# Altium schematic sheet CPU_Programmer_Schem.SchDoc
size A3; SheetNumber: 2; SheetTotal: 2
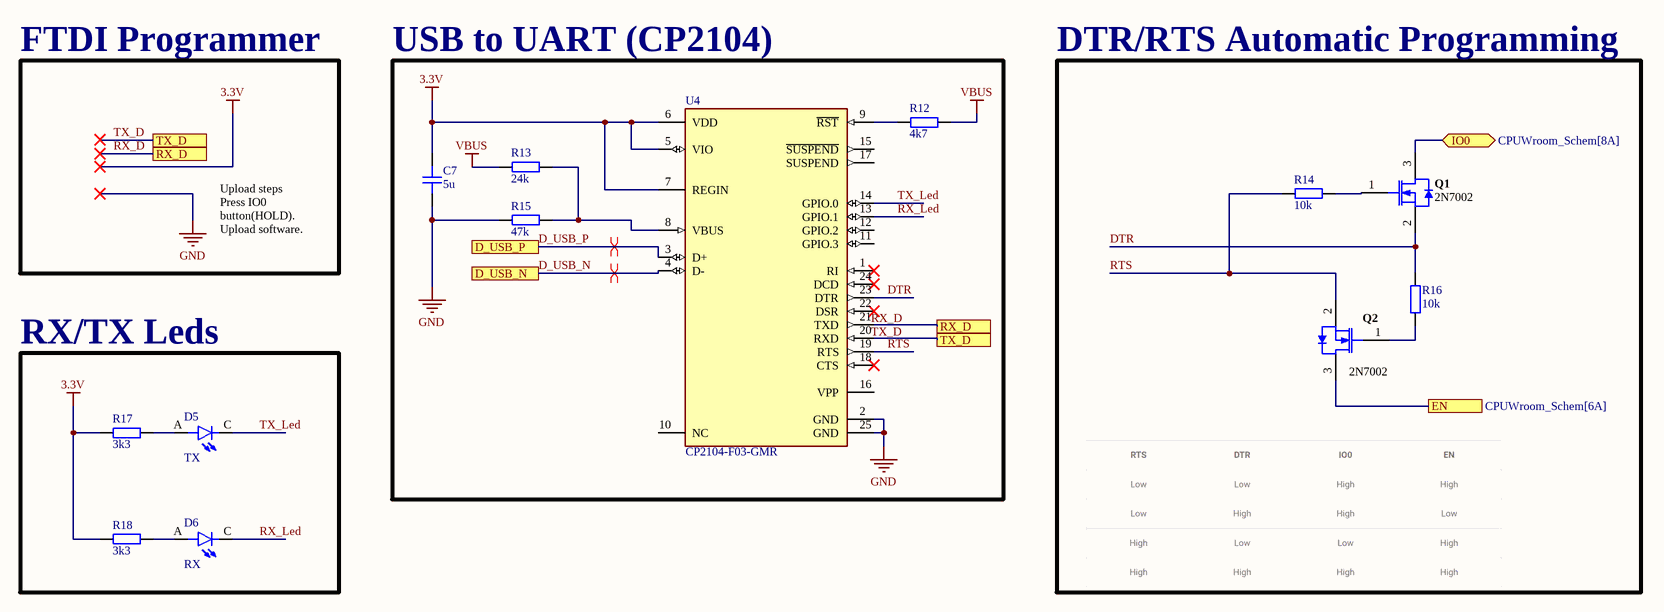
[diagram p0: CPU_Programmer_Schem.SchDoc]

## Parts
C7  5u  [CAP_1206]
D5  TX  [LED_1206]
D6  RX  [LED_1206]
Q1  2N7002  [INF-PG-SOT23_M]
Q2  2N7002  [INF-PG-SOT23_M]
R12  4k7  [RES_1206]
R13  24k  [RES_1206]
R14  10k  [RES_1206]
R15  47k  [RES_1206]
R16  10k  [RES_1206]
R17  3k3  [RES_1206]
R18  3k3  [RES_1206]
U4  CP2104-F03-GMR  [FP-CP2104-F03-GMR-MFG]

## Blocks framed on the sheet
USB to UART (CP2104): C7 R12 R13 R15 U4
DTR/RTS Automatic Programming: Q1 Q2 R14 R16
RX/TX Leds: D5 D6 R17 R18

## Ports
D_USB_N (see CPUWroom_Schem[2A]), D_USB_P (see CPUWroom_Schem[2A]), EN (see CPUWroom_Schem[6A]), IO0 (bidir, see CPUWroom_Schem[8A]), RX_D (see CPU_Programmer_Schem[1A], CPUWroom_Schem[6A]), RX_D (see CPU_Programmer_Schem[4A], CPUWroom_Schem[6A]), TX_D (see CPU_Programmer_Schem[1A], CPUWroom_Schem[6A]), TX_D (see CPU_Programmer_Schem[4A], CPUWroom_Schem[6A])

## Nets
3.3V: C7.2 R17.1 R18.1 U4.5(VIO) U4.6(VDD) U4.7(REGIN)
GND: C7.1 R15.1 U4.2(GND) U4.25(GND)
VBUS: R12.1 R13.1
D_USB_N: U4.4(D-) ; port D_USB_N
D_USB_P: U4.3(D+) ; port D_USB_P
DTR: Q1.2(SOURCE) R16.1 U4.23(DTR)
EN: Q2.3(DRAIN) ; port EN
IO0: Q1.3(DRAIN) ; port IO0
RTS: Q2.2(SOURCE) R14.1 U4.19(RTS)
RX_D: U4.21(TXD) ; port RX_D
RX_Led: D6.C U4.13(GPIO.1)
TX_D: U4.20(RXD) ; port TX_D
TX_Led: D5.C U4.14(GPIO.0)
NetD5_A: D5.A R17.2
NetD6_A: D6.A R18.2
NetQ1_1: Q1.1(GATE) R14.2
NetQ2_1: Q2.1(GATE) R16.2
NetR12_2: R12.2 U4.9(~{RST})
NetR13_2: R13.2 R15.2 U4.8(VBUS)

Not connected (* = marked no-connect by the designer): U4 1(RI)* 10(NC) 11(GPIO.3) 12(GPIO.2) 15(~{SUSPEND}) 16(VPP) 17(SUSPEND) 18(CTS)* 22(DSR)* 24(DCD)*

## Layout directives
differential pair: D_USB_N, D_USB_P

## Notes on the sheet
- FTDI Programmer
- Upload steps
  Press IO0 button(HOLD).
  Upload software.
- Labels drawn without touching a wire or pin: RX_D, TX_D

## Library data of the parts
C7 = CAP_1206_50V: Capacitor SMD 1206 50V
D5 D6 = LED - 1206: Yellow 587nm LED Indication - Discrete 2V 1206 _3216 Metric_; MF: Lite-On Inc.; MP: LTST-C230KSKT; Value: *; SnapEDA_Link: https://www.snapeda.com/parts/LTST-C230KSKT/Lite-On%20Inc./view-part/264912/?ref=snap; Availability: Unavailable; Package: 1206 Lite-On; Price: None
Q1 Q2 = CMP-1149-00026-1: N-Channel OptiMOS Small-Signal-Transistor, 60 V VDS, 0.3 A ID, -55 to 150 degC, PG-SOT23, Reel, Green; Manufacturer: Infineon; RDS (on) (max) (@4.5V): 4,000 mOhm; VDS (max): 60 V; IDpuls (max): 1.2Â A; QG: 0.4Â nC; RDS (on) (max): 3,000 mOhm; RthJA (max): 250 K/W; ID (max): 0.3Â A; VGS(th) (max): 2.5Â V; VGS(th) (min): 1.5Â V; Green: TRUE; Ptot (max): 0.5Â W; PackageDescription: 3-Pin Small Outline Transistor Package, 2.9 x 1.3 mm Body, 0.95 mm Pitch; Halogen-free: TRUE; ComponentLink2Description: Datasheet; ComponentLink1URL: http://www.infineon.com/; Packing: Reel; DatasheetVersion: Rev. 2.4; PartNumber: 2N7002; PackageReference: PG-SOT23; PackageVersion: Apr-08; ComponentLink3URL: http://www.infineon.com/dgdl/SOT23-Package_Overview.pdf?folderId=db3a30431936bc4b0119532290053c66&fileId=db3a30431936bc4b0119533468123c85; ComponentLink1Description: Manufacturer URL; Mounting Technology: Surface Mount; ComponentLink3Description: Package Specification; ComponentLink2URL: http://www.infineon.com/dgdl/2N7002_Rev2.4.pdf?folderId=db3a3043156fd573011622e10b5c1f67&fileId=db3a304319bc939a0119c2a9461e79e6
R12-R18 = RES_1206: Resistor SMD 1206
U4 = CMP-08107-000004-1: IC SGL USB-TO-UART BRIDGE 24QFN; Manufacturer: Silicon Laboratories; Max Supply Voltage: 3.6V; Min Supply Voltage: 1.8V; Nominal Supply Current: 100-17000uA; Standoff Height: 0mm; Interface: UART,USB; Temperature Range Low: -40°C; Lead Free: Yes; Device Class L3: Controllers; Ambient Temperature Range Low: -55°C; Automotive: No; Category: IC; Temperature: -40°C to +85°C; Octopart: https://octopart.com/cp2104-f03-gmr-silicon+labs-19668642; Ambient Temperature Range High: +125°C; Package: CP2104-F03-GMR; Device Class L2: Interface ICs; Digikey Description: IC SGL USB-TO-UART BRIDGE 24QFN; Device Class L1: Integrated Circuits (ICs); Manufacturer Part Number: CP2104-F03-GMR; Temperature Range High: +85°C; ComponentLink2URL: https://www.silabs.com/documents/public/data-sheets/cp2104.pdf; Height: 0.8mm; Ipc Land Pattern Name: QFN50P400X400X75-24; Mouser Description: I/O Controller Interface IC USB to UART bridge; ComponentLink2Description: Datasheet; RoHS: TRUE